# Altium schematic sheet FPGA_POWER.SchDoc
size B
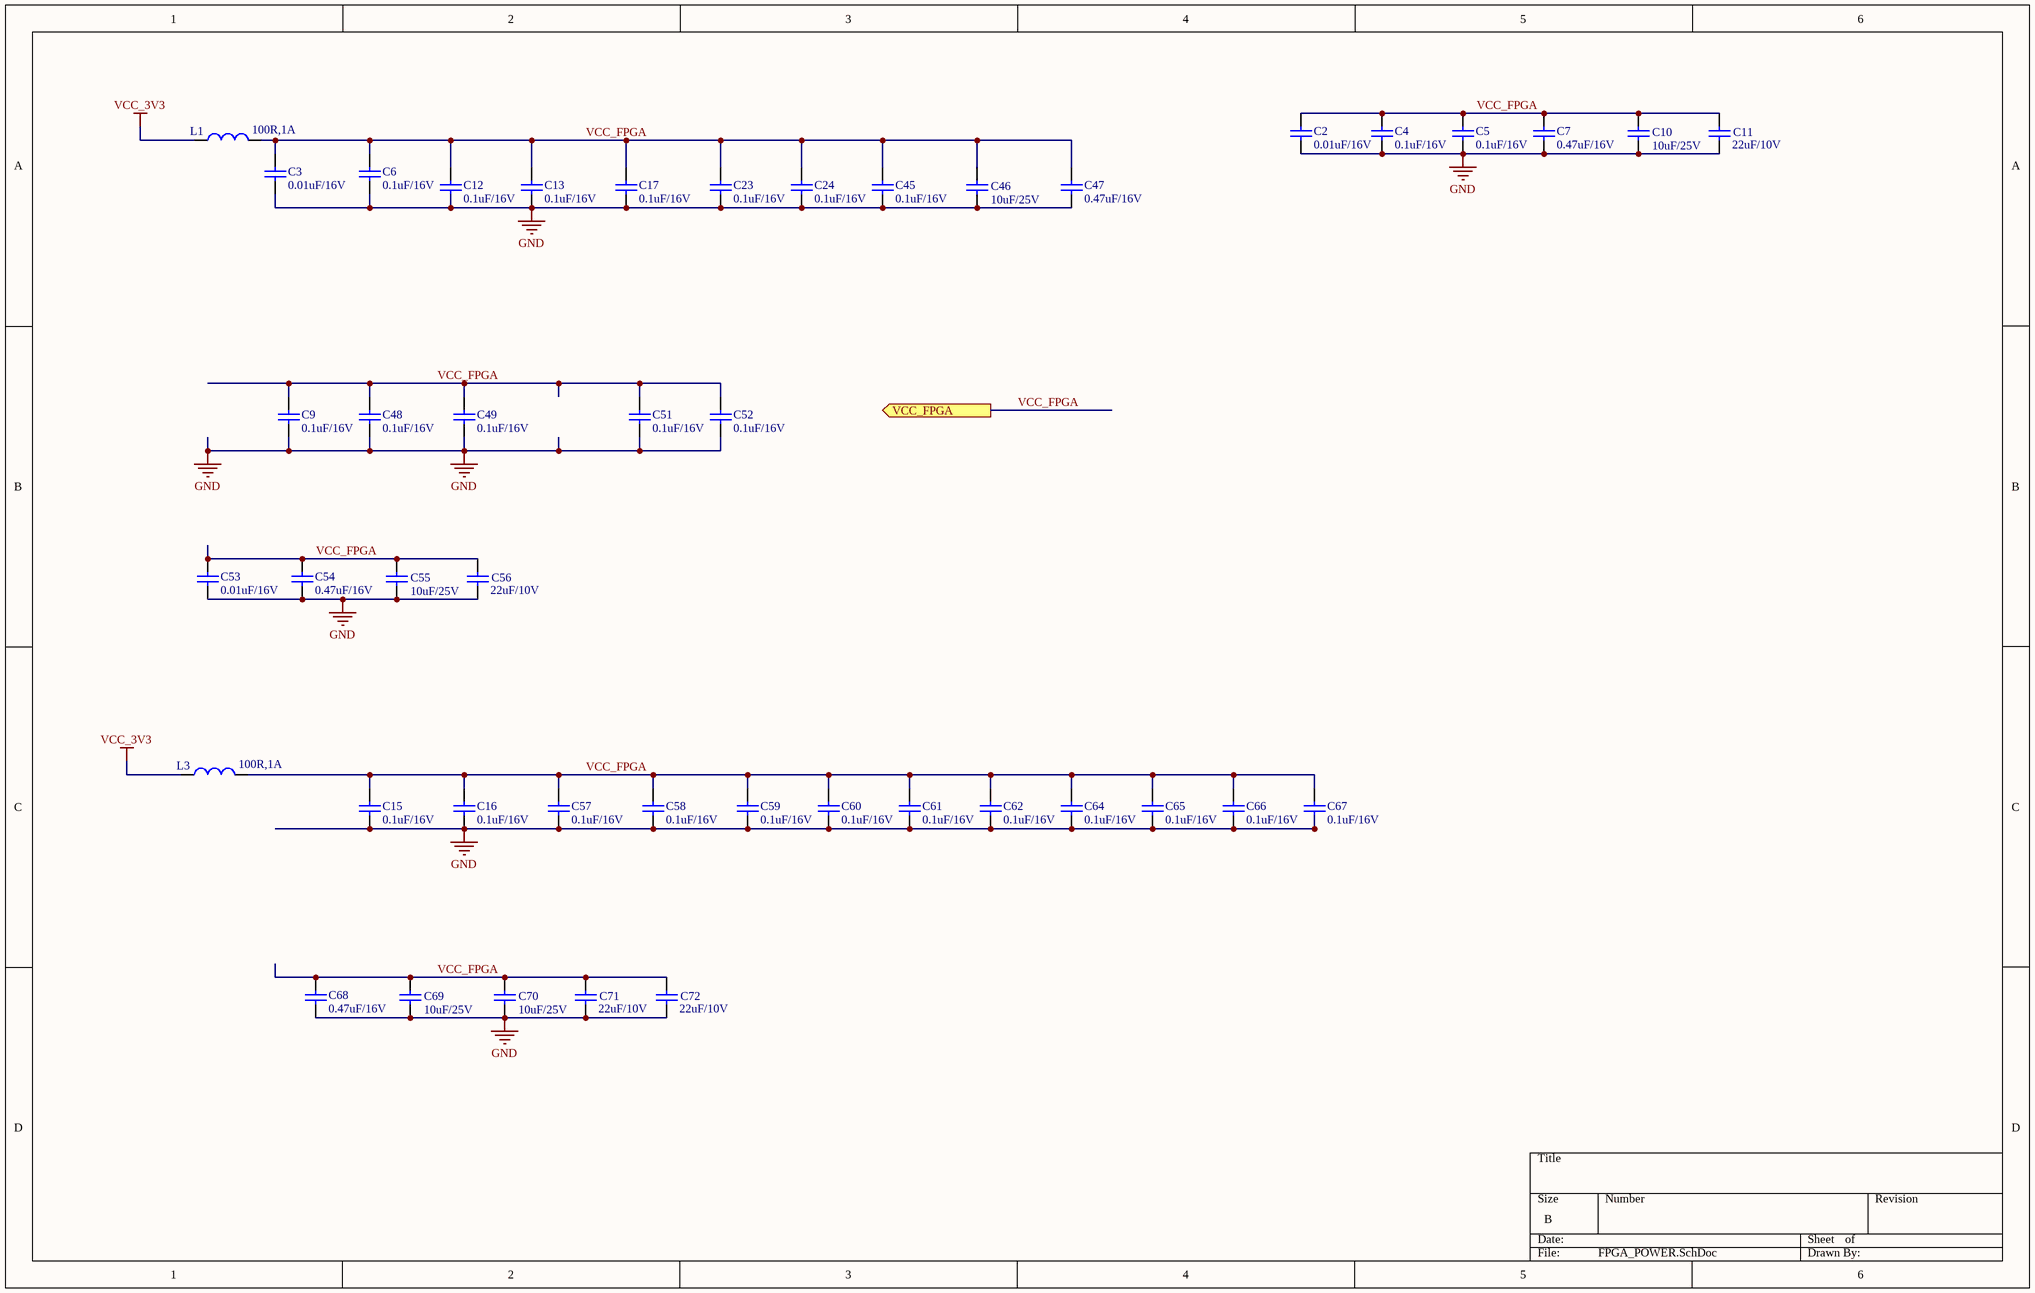
[diagram p0: FPGA_POWER.SchDoc]

## Parts
C2  0.01uF/16V  [0603C]
C3  0.01uF/16V  [0603C]
C4  0.1uF/16V  [0603C]
C5  0.1uF/16V  [0603C]
C6  0.1uF/16V  [0603C]
C7  0.47uF/16V  [0603C]
C9  0.1uF/16V  [0603C]
C10  10uF/25V  [0805C]
C11  22uF/10V  [0603C]
C12  0.1uF/16V  [0603C]
C13  0.1uF/16V  [0603C]
C15  0.1uF/16V  [0603C]
C16  0.1uF/16V  [0603C]
C17  0.1uF/16V  [0603C]
C23  0.1uF/16V  [0603C]
C24  0.1uF/16V  [0603C]
C45  0.1uF/16V  [0603C]
C46  10uF/25V  [0805C]
C47  0.47uF/16V  [0603C]
C48  0.1uF/16V  [0603C]
C49  0.1uF/16V  [0603C]
C51  0.1uF/16V  [0603C]
C52  0.1uF/16V  [0603C]
C53  0.01uF/16V  [0603C]
C54  0.47uF/16V  [0603C]
C55  10uF/25V  [0805C]
C56  22uF/10V  [0603C]
C57  0.1uF/16V  [0603C]
C58  0.1uF/16V  [0603C]
C59  0.1uF/16V  [0603C]
C60  0.1uF/16V  [0603C]
C61  0.1uF/16V  [0603C]
C62  0.1uF/16V  [0603C]
C64  0.1uF/16V  [0603C]
C65  0.1uF/16V  [0603C]
C66  0.1uF/16V  [0603C]
C67  0.1uF/16V  [0603C]
C68  0.47uF/16V  [0603C]
C69  10uF/25V  [0805C]
C70  10uF/25V  [0805C]
C71  22uF/10V  [0603C]
C72  22uF/10V  [0603C]
L1  100R,1A  [0603L]
L3  100R,1A  [0603L]

## Ports
VCC_FPGA (out)

## Nets
GND: C2.2 C3.2 C4.2 C5.2 C6.2 C7.2 C9.2 C10.1 C11.1 C12.2 C13.2 C15.2 C16.2 C17.2 C23.2 C24.2 C45.2 C46.1 C47.2 C48.2 C49.2 C51.2 C52.2 C53.2 C54.2 C55.1 C56.1 C57.2 C58.2 C59.2 C60.2 C61.2 C62.2 C64.2 C65.2 C66.2 C67.2 C68.2 C69.1 C70.1 C71.1 C72.1
VCC_3V3: L1.1 L3.1
VCC_FPGA: C2.1 C3.1 C4.1 C5.1 C6.1 C7.1 C9.1 C10.2 C11.2 C12.1 C13.1 C15.1 C16.1 C17.1 C23.1 C24.1 C45.1 C46.2 C47.1 C48.1 C49.1 C51.1 C52.1 C53.1 C54.1 C55.2 C56.2 C57.1 C58.1 C59.1 C60.1 C61.1 C62.1 C64.1 C65.1 C66.1 C67.1 C68.1 C69.2 C70.2 C71.2 C72.2 L1.2 L3.2 ; port VCC_FPGA

## Library data of the parts
C2 C3 C53 = Cap: Multilayer Ceramic Capacitors MLCC - SMD/SMT 16V 0.01uF X7R 0603 10% AEC-Q200; Mfr: KEMET; Mfr Part No: C0603C103K4RECAUTO; Package: 0603; Price: 0.151; Stockiest: MOUSER; Stockiest Part No: 80-C0603C103K4RECAUT; Value: 0.01uF/16V
C4-C6 C9 C12 C13 C15-C17 C23 C24 C45 C48 C49 C51 C52 C57-C62 C64-C67 = Cap: Multilayer Ceramic Capacitors MLCC - SMD/SMT 0603 16VDC 0.1uF 10% X7R AEC-Q200; Mfr: Taiyo Yuden; Mfr Part No: EMK107B7104KAHT; Package: 0603; Price: 0.101; Stockiest: MOUSER; Stockiest Part No: 963-EMK107B7104KAHT; Value: 0.1uF/16V
C7 C47 C54 C68 = Cap: Multilayer Ceramic Capacitors MLCC - SMD/SMT 16V 0.47uF 0603 X7R 5% AEC-Q200; Mfr: KEMET; Mfr Part No: C0603C474J4RACAUTO; Package: 0603; Price: 0.444; Stockiest: MOUSER; Stockiest Part No: 80-C0603C474J4RAUTO; Value: 0.47uF/16V
C10 C46 C55 C69 C70 = Cap: Multilayer Ceramic Capacitors MLCC - SMD/SMT 0805 25VDC 10uF 20% X5R; Mfr: Taiyo Yuden; Mfr Part No: TMK212BBJ106MG-T; Package: 0805; Price: 0.232; Stockiest: MOUSER; Stockiest Part No: 963-TMK212BBJ106MG-T; Value: 10uF/25V
C11 C56 C71 C72 = Cap: Multilayer Ceramic Capacitors MLCC - SMD/SMT 1210 25VDC 22uF 20% X7R AEC-Q200; Mfr: TDK; Mfr Part No: C1608X5R1A226M080AC; Package: 0603; Price: 0.413; Stockiest: MOUSER; Stockiest Part No: 810-C1608X5R1A226M; Value: 22uF/10V
L1 L3 = 0805_IND: Ferrite Beads 100ohms 1A 60mOhms 0603 Ferrite Chip; Mfr: TDK; Mfr Part No: MPZ1608D101BTA00; Value: 100R/1A; Package: 0603; Price: 0.10; Stockiest: MOUSER; Stockiest Part No: 810-MPZ1608D101BTA00